# EAGLE schematic Charger_Li-Ion_Li-Po_MCP73811 (EAGLE 6.5.0)
Li-Ion/Po 1 cell charger MCP738311 Datasheet <http://ww1.microchip.com/downloads/en/DeviceDoc/22036b.pdf> Connect CHG_PROG_X high for 450 mA charge Connect CHG_PROG_X to GND for 85 mA charge
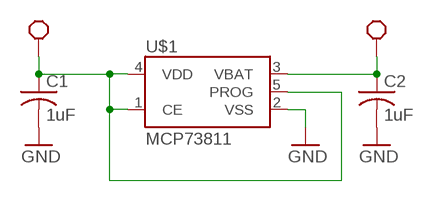
[diagram p0: schematic, sheet 1]

## Parts
C1  1uF  C-USC0603  [C0603]
C2  1uF  C-USC0603  [C0603]
U$1  MCP73811  [SOT23-5]

## Nets
3V7,#,+,O: C2.1 U$1.3(VBAT) ; supply symbol labelled BLOCK_REQUIREMENT
5V,#,+,I/5V_USB,#,+,I: C1.1 U$1.1(CE) U$1.4(VDD) U$1.5(PROG) ; supply symbol labelled BLOCK_REQUIREMENT
GND: C1.2 C2.2 U$1.2(VSS)

## Library data of the parts
C1 C2 = rcl:C-US: CAPACITOR, American symbol
U$1 = block_parts:MCP73811: The MCP73811 is a Simple, Miniature Single-Cell, Fully Integrated Li-Ion / Li-Polymer Charge Management Controller from Microchip. http://ww1.microchip.com/downloads/en/DeviceDoc/22036b.pdf